# EAGLE design plu - Copy (EAGLE 9.4.0)
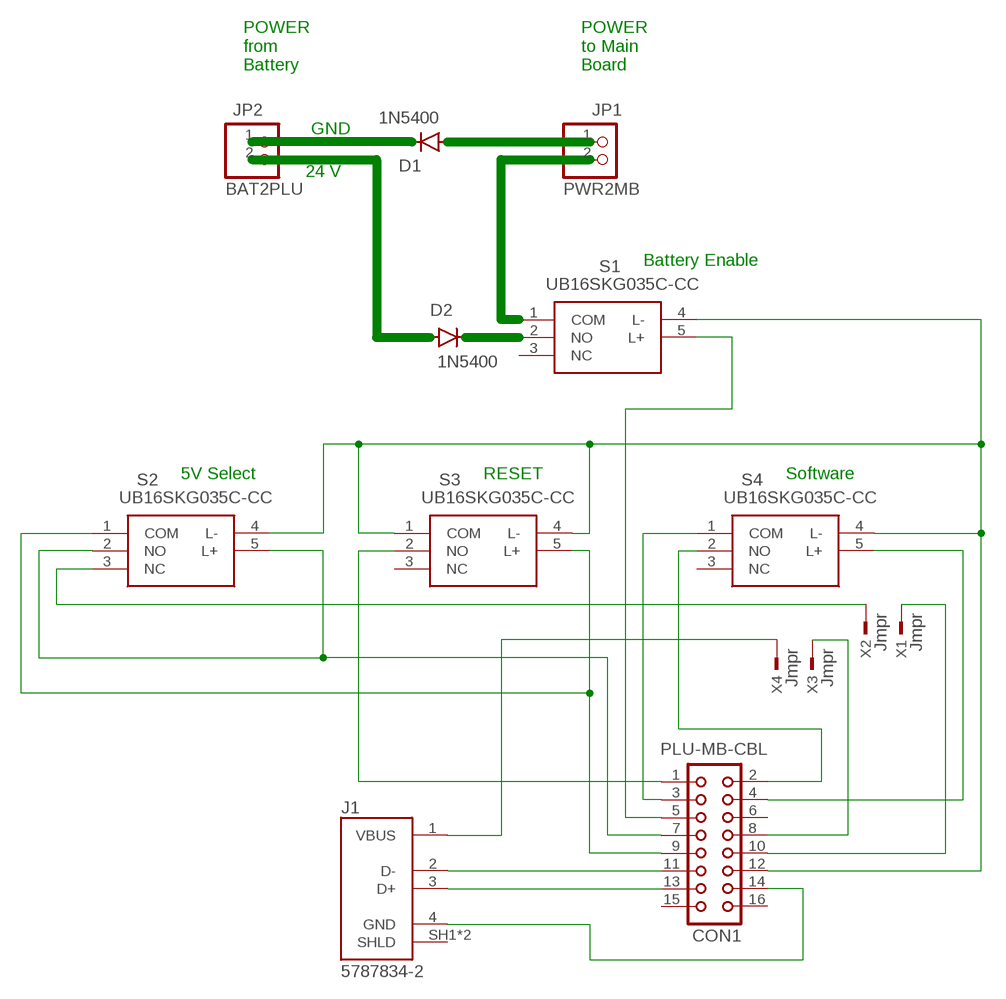
[diagram p0: schematic, sheet 1]

## Parts
CON1  PLU-MB-CBL  CON16  [CON16]
D1  1N5400  [DO201-15]
D2  1N5400  [DO201-15]
J1  5787834-2  [TE_5787834-2]
JP1  PWR2MB  PINHD-1X2  [1X02]
JP2  BAT2PLU  PINHD-1X2  [1X02]
S1  UB16SKG035C-CC  [UB16SKG035CCC]
S2  UB16SKG035C-CC  [UB16SKG035CCC]
S3  UB16SKG035C-CC  [UB16SKG035CCC]
S4  UB16SKG035C-CC  [UB16SKG035CCC]
X1  Jmpr  TSW-101-07-G-S  [TSW-101-XX-G-S]
X2  Jmpr  TSW-101-07-G-S  [TSW-101-XX-G-S]
X3  Jmpr  TSW-101-07-G-S  [TSW-101-XX-G-S]
X4  Jmpr  TSW-101-07-G-S  [TSW-101-XX-G-S]

## Nets
N$1: D1.A JP1.1
N$2: CON1.1 S3.2(NO)
N$3: D1.C JP2.1
N$4: D2.C S1.2(NO)
N$5: D2.A JP2.2
N$6: JP1.2 S1.1(COM)
N$7: CON1.11 J1.2(D-)
N$8: J1.1(VBUS) X4.1
N$11: CON1.2 S4.2(NO)
N$12: CON1.3 S4.1(COM)
N$13: CON1.13 J1.3(D+)
N$14: CON1.4 S4.5(L+)
N$15: CON1.5 S1.5(L+)
N$16: CON1.14 J1.4(GND)
N$17: CON1.7 S2.2(NO) S2.5(L+)
N$18: CON1.10 X1.1
N$19: CON1.9 S2.1(COM) S3.5(L+)
N$20: CON1.12 S1.4(L-) S2.4(L-) S3.1(COM) S3.4(L-) S4.4(L-)
N$25: S2.3(NC) X2.1
N$28: CON1.8 X3.1
Unconnected: CON1.6 CON1.15 CON1.16 J1.SH1(SHLD) J1.SH2(SHLD) S1.3(NC) S3.3(NC) S4.3(NC)

## Notes on the sheet
- POWER
  from
  Battery
- POWER
  to Main
  Board
- GND
- 24 V
- Battery Enable
- 5V Select | RESET | Software

## Library data of the parts
CON1 = con-harting:CON16: CONNECTOR; OC_FARNELL: unknown; OC_NEWARK: unknown
D1 D2 = diode:1N5400: DIODE standard rectifier, 3 A, 50 V (Motorola)
J1 = 5787834-2:5787834-2: Conn USB 2.0 Type B RCP 4 POS 2.5mm Solder ST Thru-Hole 4 Terminal 1 Port Box/Tray; COMMENT: 5787834-2; DESCRIPTION: Conn USB 2.0 Type B RCP 4 POS 2.5mm Solder ST Thru-Hole 4 Terminal 1 Port Box/Tray; DIGI-KEY_PART_NUMBER: A121598-ND; DIGI-KEY_PURCHASE_URL: https://www.digikey.com/product-detail/en/te-connectivity-amp-connectors/5787834-2/A121598-ND/2286710?utm_source=snapeda&utm_medium=aggregator&utm_campaign=symbol; EU_ROHS_COMPLIANCE: Compliant; MF: TE Connectivity; MP: 5787834-2; PACKAGE: None; TE_PURCHASE_URL: https://www.te.com/usa-en/product-5787834-2.html?te_bu=Cor&te_type=disp&te_campaign=seda_glo_cor-seda-global-disp-prtnr-fy19-seda-model-bom-cta_sma-317_1&elqCampaignId=32493
JP1 JP2 = pinhead:PINHD-1X2: PIN HEADER
S1-S4 = UB16SKG035C-CC:UB16SKG035C-CC: Pushbutton Switches ON-ON SQ .4VA RED LED & CAP PC TERM Source: Datasheet <https://www.mouser.com/datasheet/2/295/UBIlluminated-33436.pdf>; ALLIED_NUMBER: 71044456; ALLIED_PRICE-STOCK: https://www.alliedelec.com/nkkswitches-ub16skg035c-cc/71044456/; DESCRIPTION: Pushbutton Switches ON-ON SQ .4VA RED LED & CAP PC TERM; HEIGHT: 13.5mm; MANUFACTURER_NAME: NKK Switches; MANUFACTURER_PART_NUMBER: UB16SKG035C-CC; MOUSER_PART_NUMBER: 633-UB16SKG035CCC; MOUSER_PRICE-STOCK: https://www.mouser.com/Search/Refine.aspx?Keyword=633-UB16SKG035CCC
X1-X4 = con-samtec:TSW-101-*-G-S: THROUGH-HOLE .025" SQ POST HEADER Source: Samtec TSW.pdf; MF: Samtec Inc.; MPN: TSW-101-07-G-S

## Net classes
0 default: width 0.406 mm

## Board
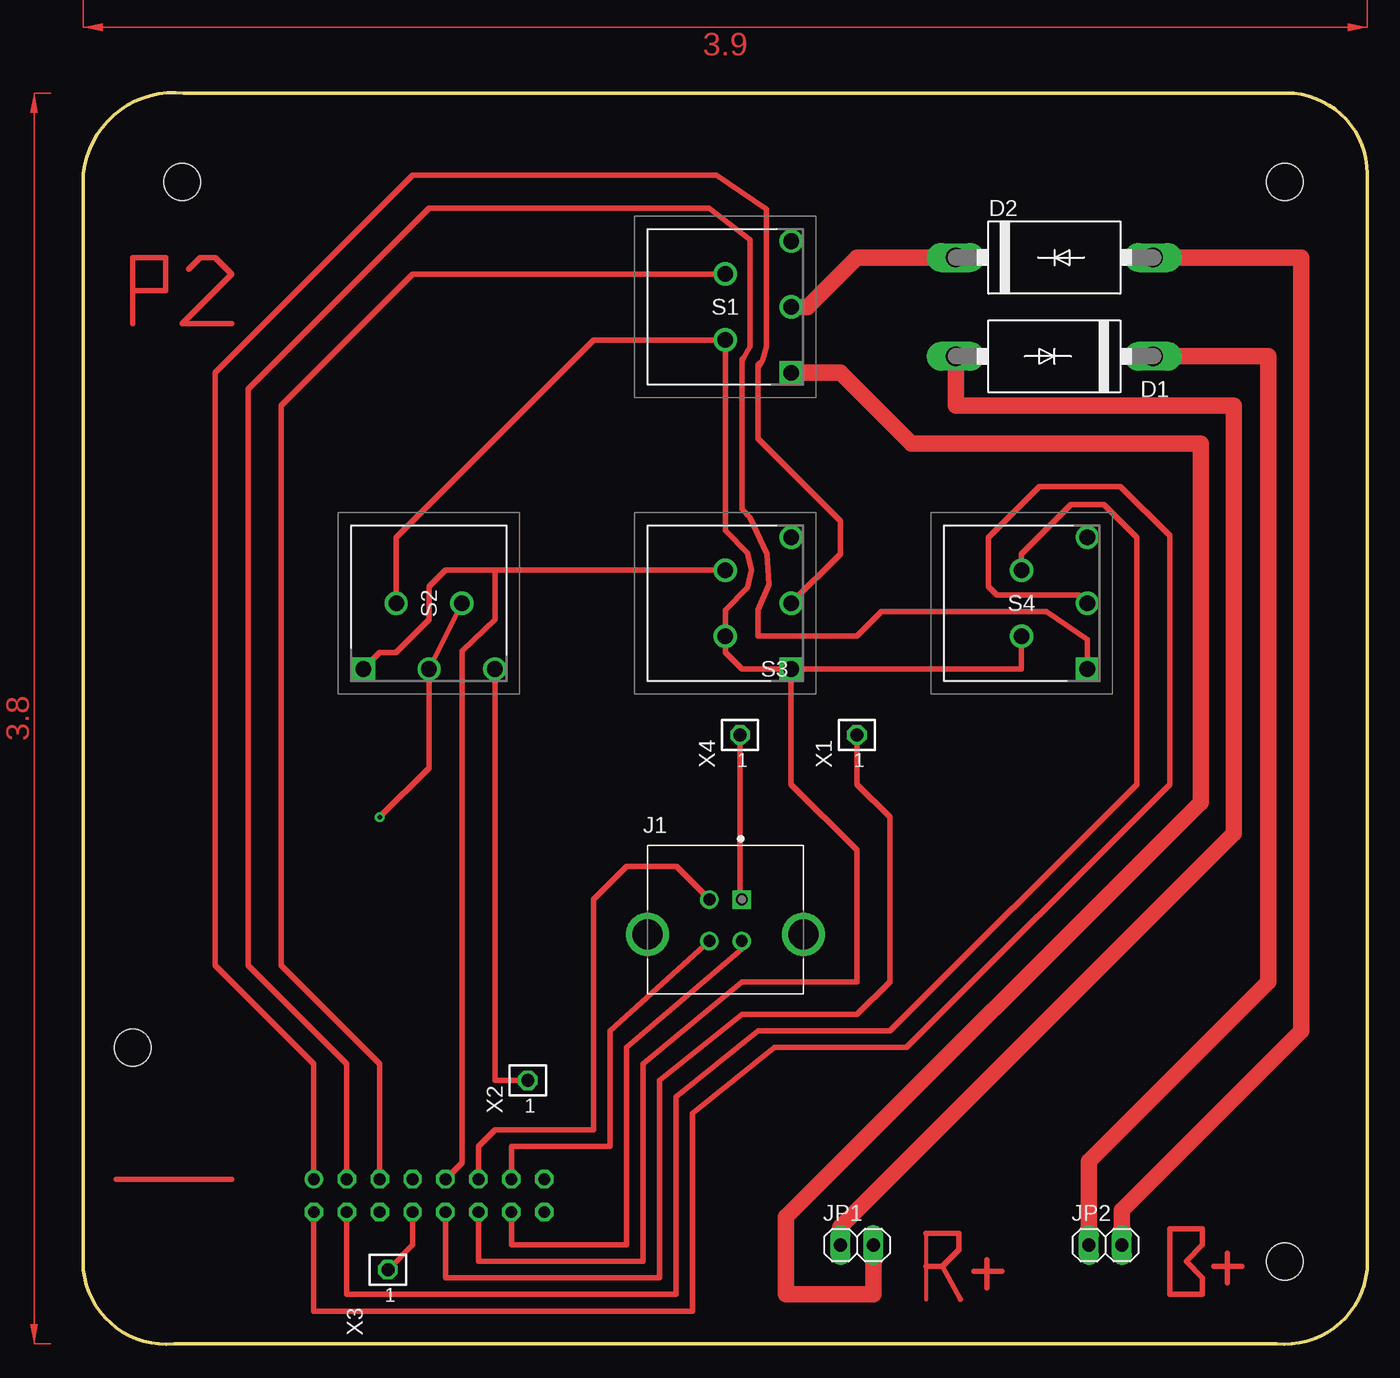
[diagram p1: board, top side]
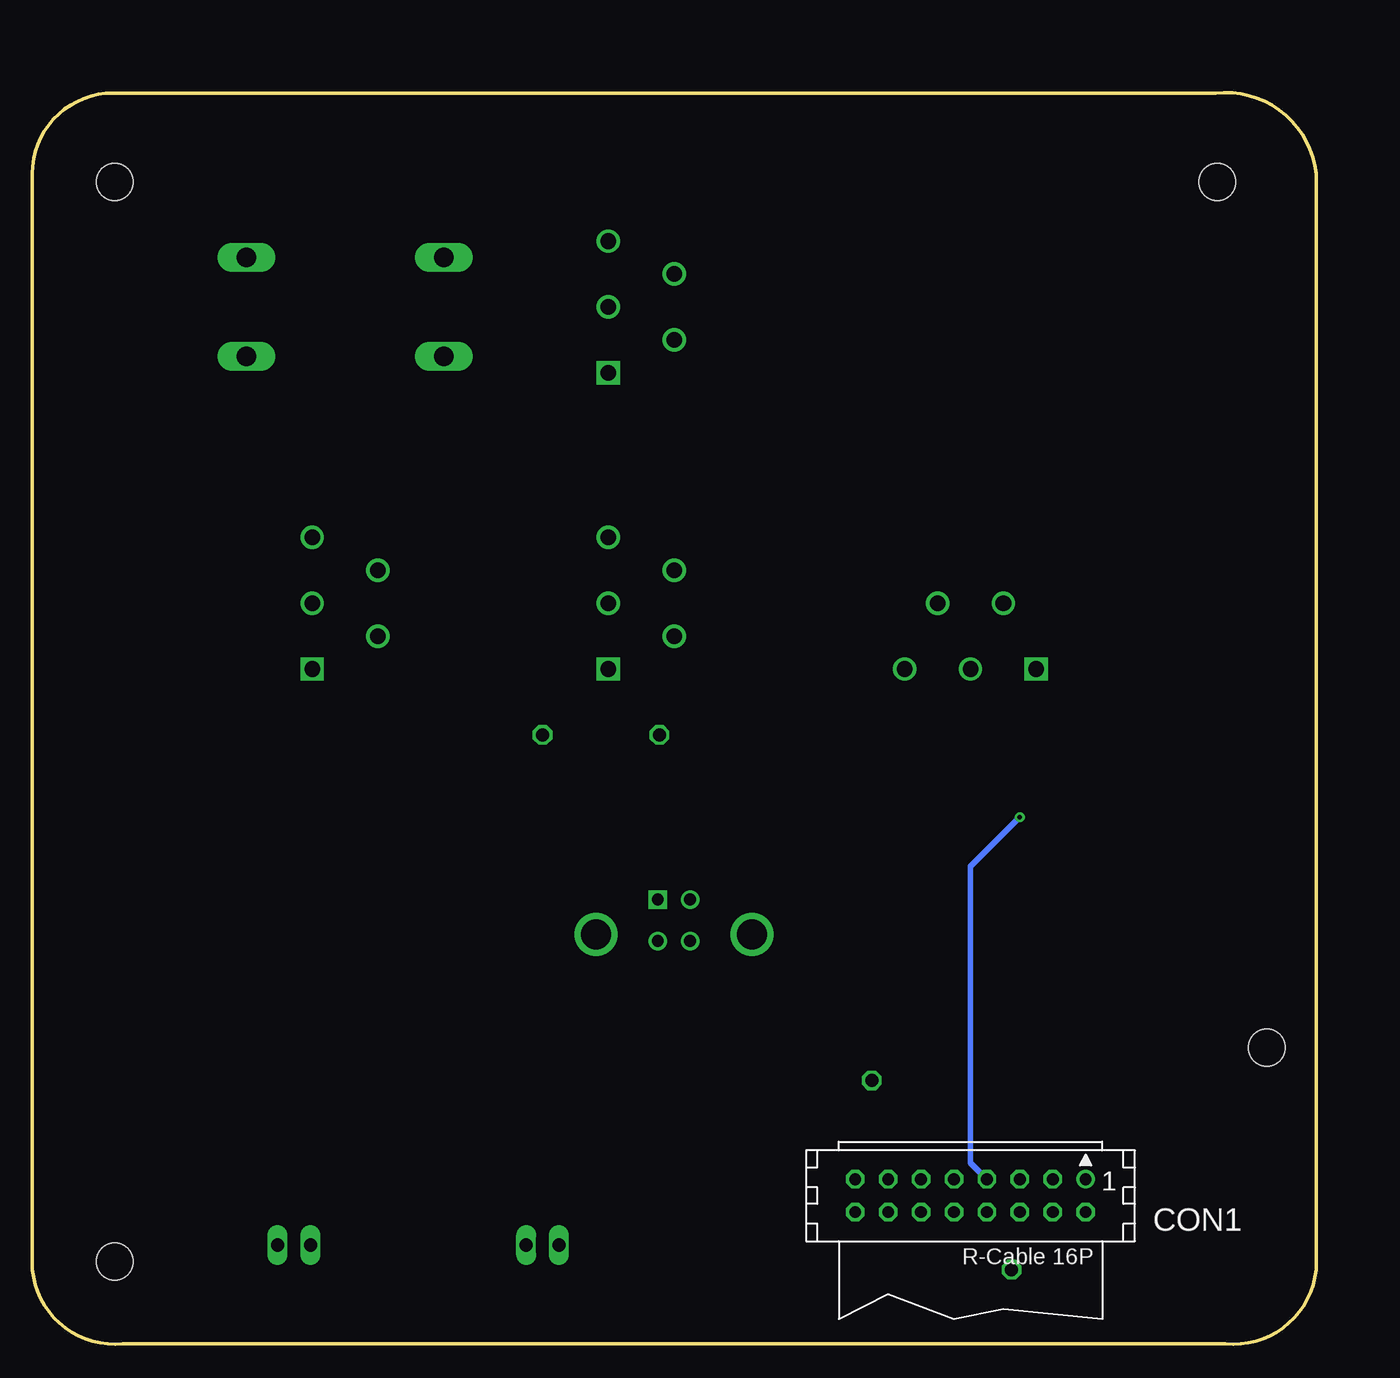
[diagram p2: board, bottom side, seen from below]

Size 99.06 x 96.59 mm. Coordinates in mm from the lower left corner, seen from the top.
Outline: 99.06,90.33 arc90 92.84,96.55 7.75,96.55 arc90 0,90.33 0,5.75 arc90 6.99,0.03 92.08,0.03 arc90 99.06,5.75 99.06,90.33
Copper layers (1*16): Top 0.035mm / dielectric 1.5mm / Bottom 0.035mm
Design rules "default": minimum track width 6mil, minimum drill 0.35mm, track to track 6mil, track to pad 6mil, pad to pad 6mil, via to via 6mil, smd to smd 6mil, copper to edge 40mil, drill to drill 6mil, minimum pad ring 10mil, minimum via ring 8mil, stop-mask expansion 4mil, vias tented up to drill 0mil, thermal gap 10mil
Holes 2.85 mm at 92.71,89.69 3.81,22.89 7.62,89.69 92.71,6.38

### Footprints (pad centres in the part's own frame; a part is rotated, then mirrored left to right if it is on the bottom)
CON16 = drill 0.914: 1 -8.89,-1.27 | drill 0.914 octagon: 2 -8.89,1.27; 3 -6.35,-1.27; 4 -6.35,1.27; 5 -3.81,-1.27; 6 -3.81,1.27; 7 -1.27,-1.27; 8 -1.27,1.27; 9 1.27,-1.27; 10 1.27,1.27; 11 3.81,-1.27; 12 3.81,1.27; 13 6.35,-1.27; 14 6.35,1.27; 15 8.89,-1.27; 16 8.89,1.27
DO201-15 = drill 1.499 long: A 7.62,0; C -7.62,0
TE_5787834-2 = drill 0.92 square: 1 0,0 | drill 0.92: 2 -2.5,0; 3 -2.5,-3.21; 4 0,-3.21 | drill 2.3: SH1 -7.27,-2.705; SH2 4.77,-2.705
1X02 = drill 1.016 long: 1 -1.27,0; 2 1.27,0
UB16SKG035CCC = drill 1.2 pad 1.8 square: 1 0,0 | drill 1.2 pad 1.8: 2 0,5.08; 3 0,10.16; 4 -5.08,2.54; 5 -5.08,7.62
TSW-101-XX-G-S = drill 1 pad 1.5 octagon: 1 0,0

### Placement (x,y rotation side)
CON1  26.67,11.46 180 bottom
D1  74.93,76.23 180 top
D2  74.93,83.85 0 top
J1  50.8,34.32 0 top
JP1  59.69,7.65 0 top
JP2  78.87,7.65 0 top
S1  54.61,74.96 0 top
S2  21.59,52.1 270 top
S3  54.61,52.1 0 top
S4  77.47,52.1 0 top
X1  59.69,47.02 0 top
X2  34.29,20.35 0 top
X3  23.49,5.75 0 top
X4  50.67,47.02 0 top

### Tracks (layer width: path | path; a pad name or v marks a point on that pad's centre or on a via)
N$1
  Top 1.27: D1.A 67.31,72.42 88.77,72.42 88.77,39.4 58.42,9.05 JP1.1
N$2
  Top 0.406: S3.2 58.42,60.99 58.42,63.53 52.07,69.88 52.07,75.34 | CON1.1 17.78,21.62 10.16,29.24 10.16,74.96 25.4,90.2 48.85,90.2 52.7,87.57 52.7,76.99 52.39,75.91 | 52.39,75.91 52.07,75.6 52.07,75.34 | 52.39,75.91 52.07,75.34
N$3
  Top 1.27: D1.C 91.44,76.23 91.44,27.97 77.6,14.13 JP2.1
N$4
  Top 1.27: D2.C 59.69,83.85 55.88,80.04 S1.2
N$5
  Top 1.27: D2.A 93.98,83.85 93.98,24.16 80.14,10.32 JP2.2
N$6
  Top 1.27: S1.1 58.42,74.96 63.88,69.5 86.23,69.5 86.23,41.81 54.23,9.81 54.23,3.84 60.96,3.84 JP1.2
N$7
  Top 0.406: J1.2 45.76,36.86 41.91,36.86 39.37,34.32 39.37,16.54 31.75,16.54 30.48,15.27 CON1.11
N$8
  Top 0.406: X4.1 50.67,34.45 J1.1
N$9
  Top 0.406: 83.82,8.92 86.36,8.92 86.36,7.65 85.09,6.38 86.36,5.11 86.36,3.84 83.82,3.84 83.82,8.92
N$10
  Top 0.406: 3.81,81.31 3.81,83.85 6.35,83.85 6.35,81.31 3.81,81.31 | 3.81,81.31 3.81,78.77
N$11
  Top 0.406: S4.2 76.83,57.82 70.48,57.82 69.85,58.45 69.85,62.26 73.79,66.2 80.01,66.2 83.82,62.39 83.82,43.21 63.5,22.89 53.34,22.89 46.99,17.81 46.99,2.52 17.78,2.52 CON1.2
N$12
  Top 0.406: CON1.3 20.32,21.62 12.7,29.24 12.7,73.69 26.67,87.66 48.26,87.66 51.43,85.22 51.43,76.99 50.93,76.1 50.8,75.98 50.8,64.44 51.43,63.8 52.76,60.96 52.89,58.64 52.07,56.67 52.07,54.64 59.69,54.64 61.59,56.55 74.3,56.55 77.47,54.39 S4.1
N$13
  Top 0.406: CON1.13 33.02,15.27 40.64,15.27 40.64,24.16 J1.3
N$14
  Top 0.406: S4.5 72.39,60.99 76.2,64.8 78.74,64.8 81.28,62.26 81.28,43.21 62.23,24.16 52.07,24.16 45.72,19.08 45.72,3.84 20.32,3.84 CON1.4
N$15
  Top 0.406: S1.5 25.4,82.58 15.24,72.42 15.24,29.24 22.86,21.62 CON1.5
N$16
  Top 0.406: CON1.14 33.02,7.65 41.91,7.65 41.91,22.89 50.8,30.51 J1.4
N$17  (via drill 0.35)
  Top 0.406: S2.5 S2.2 26.67,44.48 v22.86,40.67
  Bottom 0.406: CON1.7 26.67,14 26.67,36.86 v22.86,40.67
N$18
  Top 0.406: CON1.10 27.94,5.11 44.45,5.11 44.45,20.35 50.8,25.43 59.69,25.43 62.23,27.97 62.23,40.67 59.69,43.21 X1.1
N$19
  Top 0.406: S2.1 22.86,53.37 24.13,53.37 26.67,55.91 26.67,58.45 27.94,59.72 31.75,59.72 | CON1.9 29.21,14 29.21,53.5 31.75,55.91 31.75,59.72 | S3.5 31.75,59.72
N$20
  Top 0.406: S2.4 24.13,62.26 39.37,77.5 S1.4 49.53,62.77 51.24,61.05 51.56,59.72 51.24,58.39 49.53,56.67 S3.4 49.53,53.37 50.8,52.1 S3.1 | S3.1 72.39,52.1 S4.4 | CON1.12 30.48,6.38 43.18,6.38 43.18,21.62 50.8,27.97 59.69,27.97 59.69,38.13 54.61,43.21 S3.1
N$21
  Top 0.406: 88.27,7.02 88.27,6 | 88.27,6 88.27,4.73 | 88.27,6 89.41,6 | 88.27,6 87.25,6
N$22
  Top 0.406: 2.54,12.73 11.43,12.73
N$25
  Top 0.406: S2.3 31.75,20.35 X2.1
N$26
  Top 0.406: 8.13,82.96 9.02,83.85 10.16,83.85 11.43,82.58 7.62,78.77 11.43,78.77
N$27
  Top 0.305: 65.02,3.46 65.02,6 65.02,8.54
  Top 0.406: 65.02,6 66.29,6 | 65.02,8.54 67.56,8.54 67.56,7.27 66.29,6 | 67.69,3.46 66.29,6
N$28
  Top 0.406: CON1.8 25.4,7.65 X3.1
N$33
  Top 0.406: 68.71,5.62 69.72,5.62 | 69.72,5.62 70.87,5.62 | 69.72,5.62 69.72,6.51 | 69.72,5.62 69.72,4.35
(copper drawn outside any net)
  shapes: Top area x2